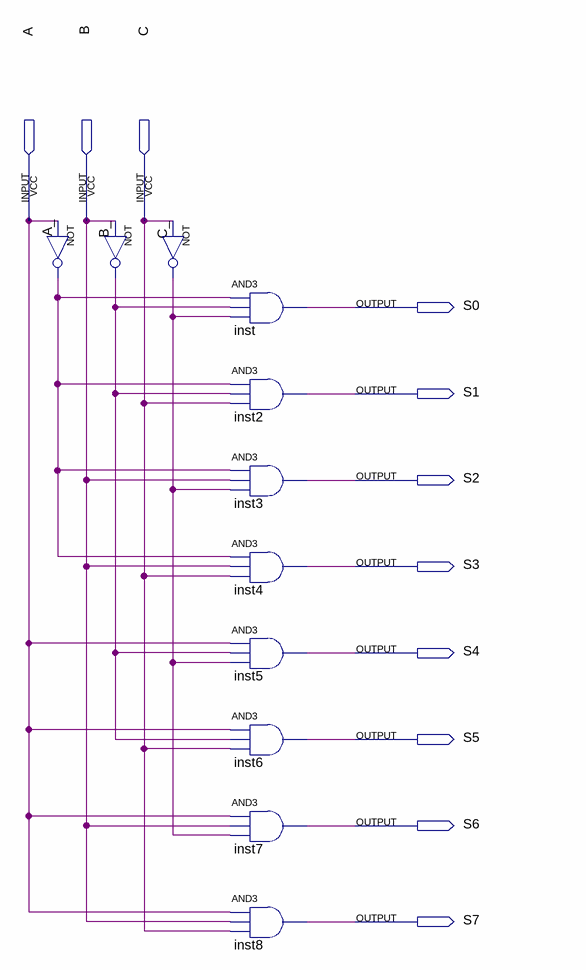
[diagram p0: schematic sheet]
// Quartus schematic DECODER3_8.bdf as structural Verilog: 11 symbols, 11 pins
module DECODER3_8 (
  input  A,
  input  B,
  input  C,
  output S0,
  output S1,
  output S2,
  output S3,
  output S4,
  output S5,
  output S6,
  output S7
);

  wire A__out, B__out, C__out;

  not A_ (A__out, A);
  not B_ (B__out, B);
  not C_ (C__out, C);
  and inst (S0, A__out, B__out, C__out);
  and inst2 (S1, A__out, B__out, C);
  and inst3 (S2, A__out, B, C__out);
  and inst4 (S3, A__out, B, C);
  and inst5 (S4, A, B__out, C__out);
  and inst6 (S5, A, B__out, C);
  and inst7 (S6, A, B, C__out);
  and inst8 (S7, A, B, C);
endmodule
